# Altium schematic sheet Top Level.SchDoc
size B; Author: AM; CompanyName: Expatria Technologies; DrawnBy: A.Marles; Engineer: AM; Organization: Expatria Technologies; Address1: 1136 Glade Court; Address2: Port Coquitlam, BC V3B 1R5; Address3: CANADA; DocumentNumber: 2; Revision: A1; SheetNumber: 2; SheetTotal: 14
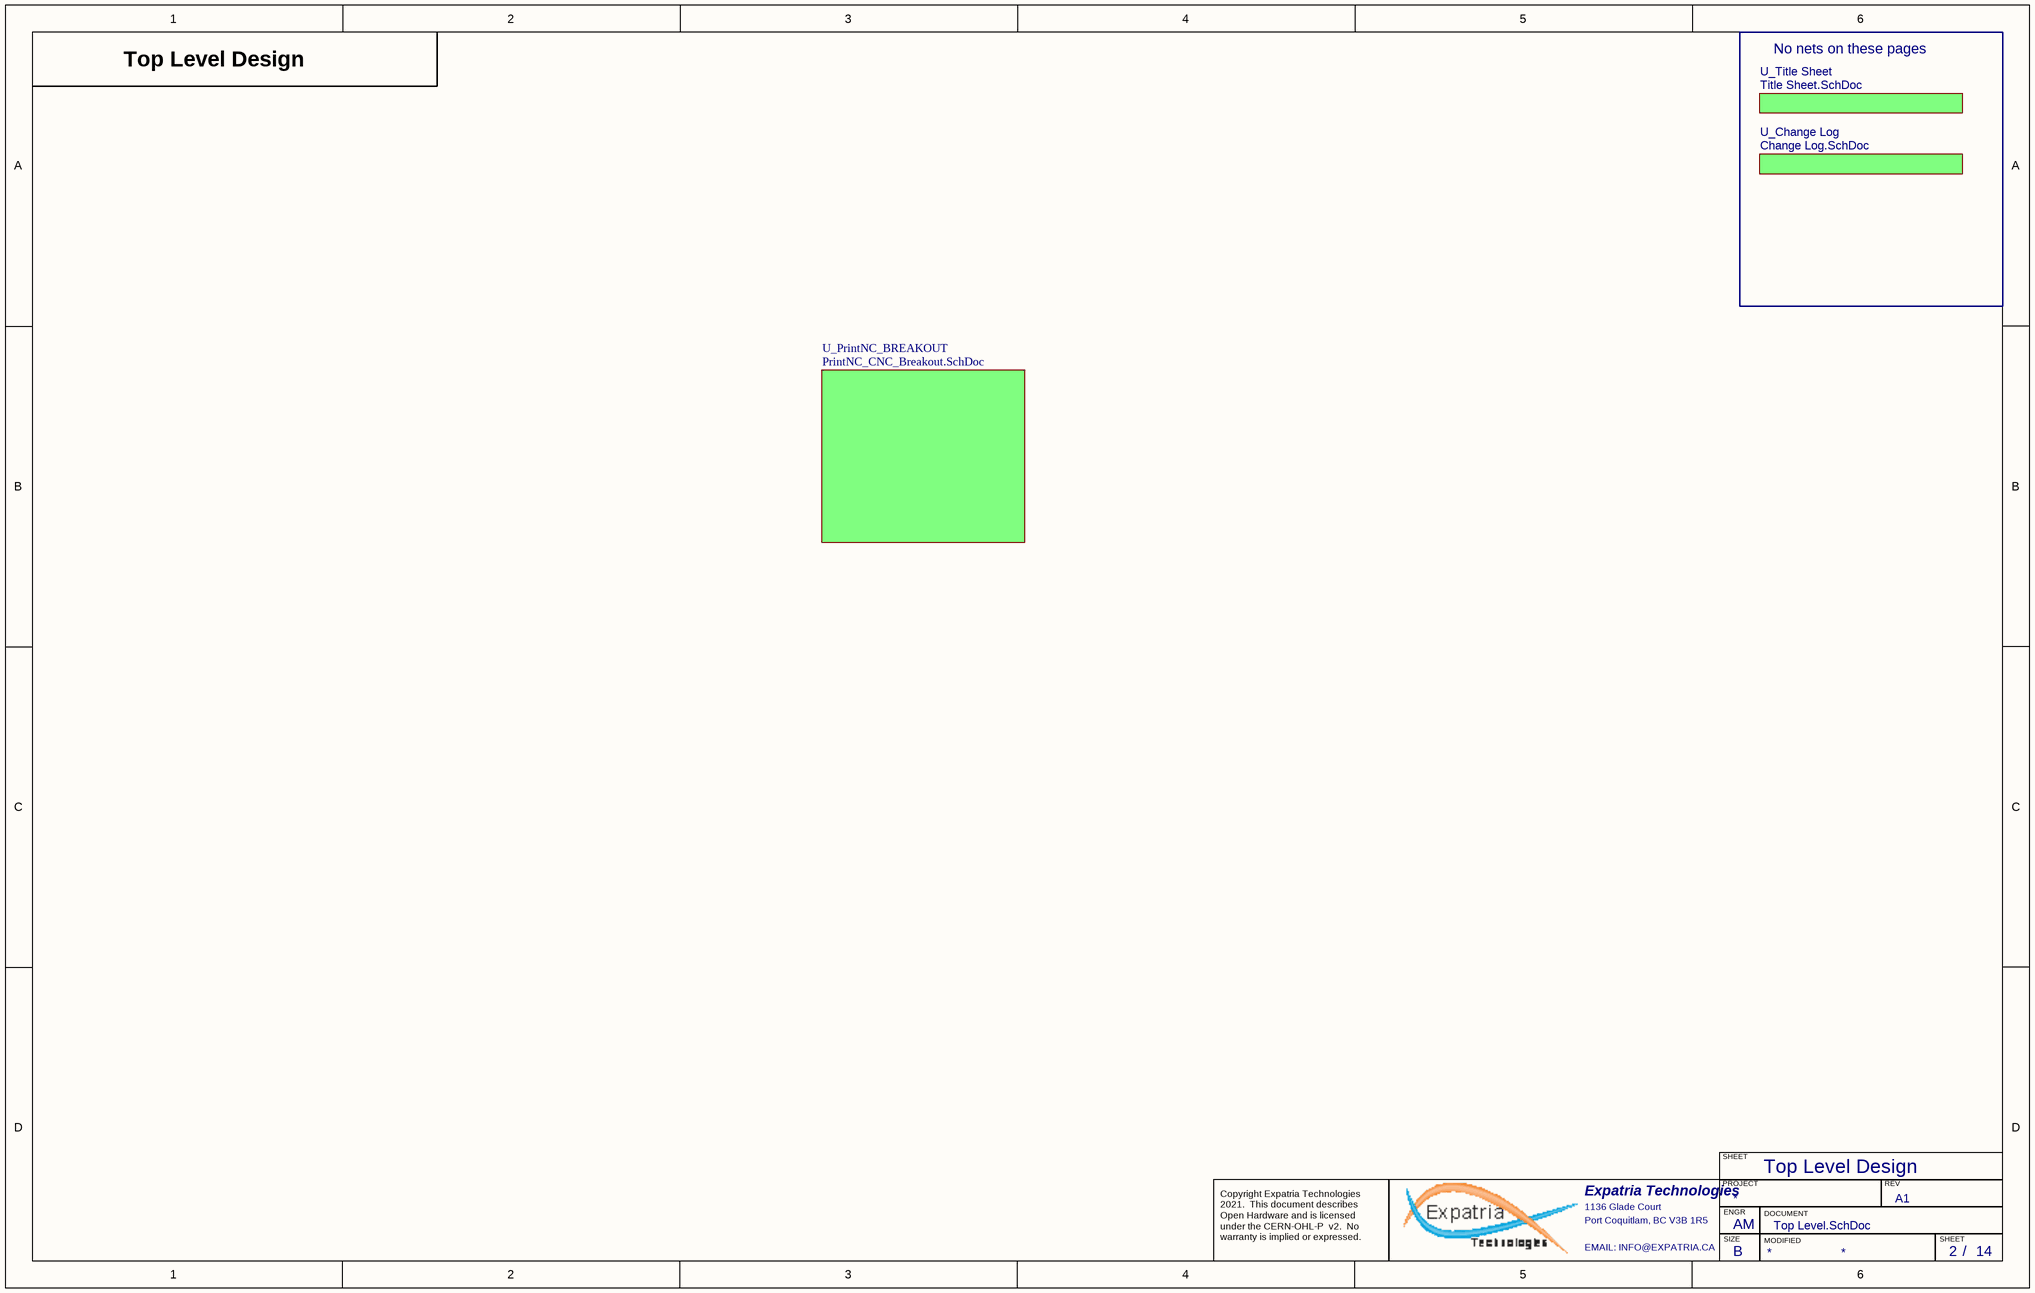
[diagram p0: Top Level.SchDoc]

## Sub-sheets
U_Change Log = Change Log.SchDoc: no entries
U_PrintNC_BREAKOUT = PrintNC_CNC_Breakout.SchDoc: no entries
U_Title Sheet = Title Sheet.SchDoc: no entries

## Notes on the sheet
- Top Level Design
- No nets on these pages
- SHEET
- Expatria Technologies
- 1136 Glade Court
- Port Coquitlam, BC V3B 1R5
- PROJECT
- SIZE
- ENGR
- MODIFIED
- DOCUMENT
- REV
- Copyright Expatria Technologies 2021.  This document describes Open Hardware and is licensed under the CERN-OHL-P  v2.  No warranty is implied or expressed.
- EMAIL: INFO@EXPATRIA.CA
- B
- /